# Altium schematic sheet Power.SchDoc
size A4
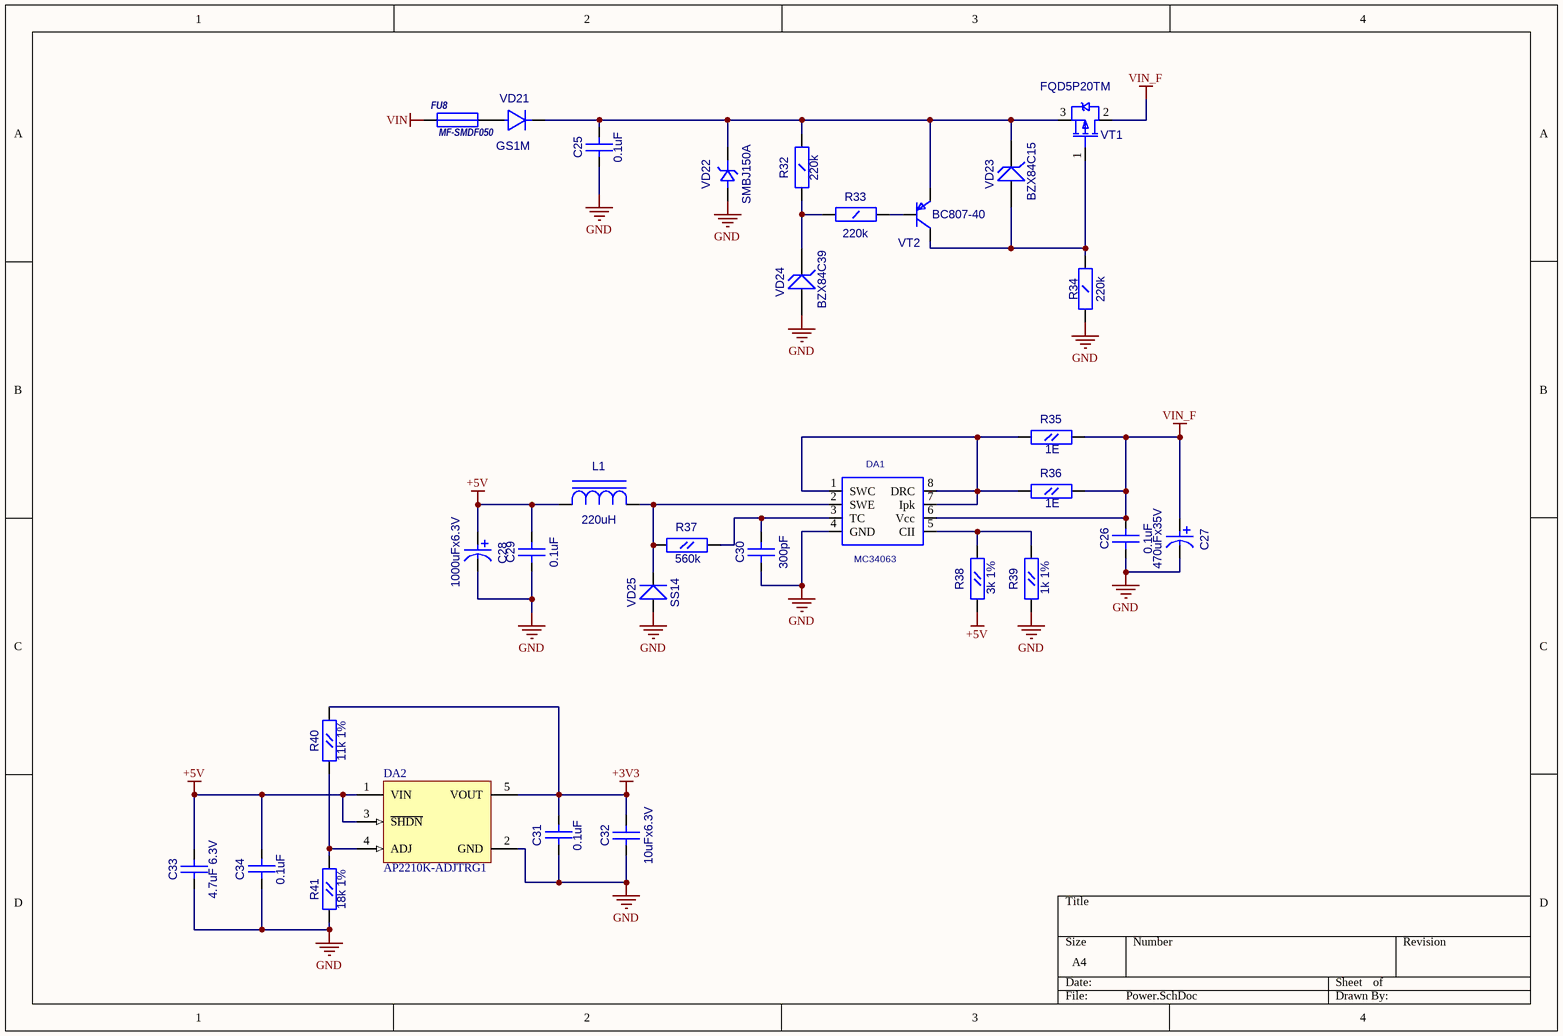
[diagram p0: Power.SchDoc]

## Parts
C25  0.1uF  [CC1206]
C26  0.1uF  [CC0603]
C27  470uFx35V  [CC16X10_CAP0.5(1)(Primary)]
C28  1000uFx6.3V  [CC8X3.5]
C29  0.1uF  [CC0603]
C30  300pF  [CC0603]
C31  0.1uF  [CC0603]
C32  10uFx6.3V  [CC0805]
C33  4.7uF 6.3V  [CC0805]
C34  0.1uF  [CC0603]
DA1  MC34063  [SO-8]
DA2  AP2210K-ADJTRG1  [SOT23-5]
FU8  MF-SMDF050  [MF-SMDF]
L1  220uH  [SDR0805]
R32  220k  [RC1206]
R33  220k  [RC1206]
R34  220k  [RC1206]
R35  1E  [RC0805]
R36  1E  [RC0805]
R37  560k  [RC0603]
R38  3k 1%  [RC0603]
R39  1k 1%  [RC0603]
R40  11k 1%  [RC0603]
R41  18k 1%  [RC0603]
VD21  GS1M  [SMA]
VD22  SMBJ150A  [SMB]
VD23  BZX84C15  [SOT-23(123)]
VD24  BZX84C39  [SOT-23(123)]
VD25  SS14  [SMA]
VT1  FQD5P20TM  [D-PAK(TO-252AA)]
VT2  BC807-40  [SOT-23(123)]

## Nets
+3V3: C31.1(A) C32.2(B) DA2.5(VOUT) R40.2(B)
+5V: C28.1 C29.2(B) C33.2(B) C34.1(A) DA2.1(VIN) DA2.3(~{SHDN}) L1.1(C) R38.1(A)
GND: C25.1(A) C26.1(A) C27.1 C28.2 C29.1(A) C30.1(A) C31.2(B) C32.1(A) C33.1(A) C34.2(B) DA1.4(GND) DA2.2(GND) R34.2(B) R39.1(A) R41.1(A) VD22.1(A) VD24.1(A) VD25.1(A)
VIN: FU8.1
VIN_F: C26.2(B) C27.2 DA1.6(Vcc) R35.2(B) R36.2(B) VT1.2(D)
NetC25_2: C25.2(B) R32.2(B) VD21.2(K) VD22.2(K) VD23.3(K) VT1.3(S) VT2.2(E)
NetC30_2: C30.2(B) DA1.3(TC) R37.2(B)
NetDA1_1: DA1.1(SWC) DA1.7(Ipk) DA1.8(DRC) R35.1(A) R36.1(A)
NetDA1_2: DA1.2(SWE) L1.2(A) R37.1(A) VD25.2(K)
NetDA1_5: DA1.5(CII) R38.2(B) R39.2(B)
NetDA2_4: DA2.4(ADJ) R40.1(A) R41.2(B)
NetFU8_2: FU8.2 VD21.1(A)
NetR32_1: R32.1(A) R33.1(A) VD24.3(K)
NetR33_2: R33.2(B) VT2.1(B)
NetR34_1: R34.1(A) VD23.1(A) VT1.1(G) VT2.3(C)

## Library data of the parts
C25 = CC1206: Value: 0.1uF
C26 C29-C31 C34 = CC0603
  C26 C29 C31 C34: Value: 0.1uF
  C30: Value: 300pF
C27 = CAP0.5(1): Value: 470uFx35V
C28 = CAP0.35: Value: 1000uFx6.3V
C32 C33 = CC0805
  C32: Value: 10uFx6.3V
  C33: Value: 4.7uF 6.3V
DA2 = MCP1824T-ADJE/OT: 300 mA, Low Voltage, Low Quiescent Current LDO Regulator, 5-Pin SOT-223, Extended Temperature, Tape and Reel; Published: 29-Jan-2009; DatasheetVersion: revA, Aug-2007; PackageVersion: revAW, Oct-2008; PackageReference: SOT-223-DC5; Publisher: Altium Limited; PackageDescription: 5-Lead Plastic Small Outline Transistor (DC) [SOT-223]; ComponentLink1Description: Manufacturer Link; ComponentLink1URL: http://www.microchip.com; ComponentLink2Description: Datasheet; ComponentLink2URL: http://ww1.microchip.com/downloads/en/DeviceDoc/22070a.pdf; ComponentLink3Description: Packaging Specification; ComponentLink3URL: http://ww1.microchip.com/downloads/en/PackagingSpec/00049AW.pdf
FU8 = MF-SMDF: Value: MF-SMDF050
L1 = SDR0805: Value: 220uH
R32-R34 = RC1206: Value: 220k
R35 R36 = RC0805: Value: 1E
R37-R41 = RC0603
  R37: Value: 560k
  R38: Value: 3k 1%
  R39: Value: 1k 1%
  R40: Value: 11k 1%
  R41: Value: 18k 1%
VD21 = GS1M: Value: {Value}
VD22 = SMBJ: Value: SMBJ150A
VD23 VD24 = BZX84: Zener Voltage Regulator Diode; Value: {Value}
VD25 = SS14: Schottky Rectifier; OriginalName: 10BQ100; ComponentField6: Published 8-Jun-2000, Modified 10-July-2000: SIM Model Added.; Value: SS14
VT1 = IRFR9220: HEXFET Power MOSFET; OriginalName: IRLML5103; ComponentField7: Published 8-Jun-2000; Value: FQD5P20TM
VT2 = BC857B: OriginalName: BC846BLT1; ComponentField7: Published 29-Sep-2000; Value: BC807-40
DA1 = MC34063: Value: *